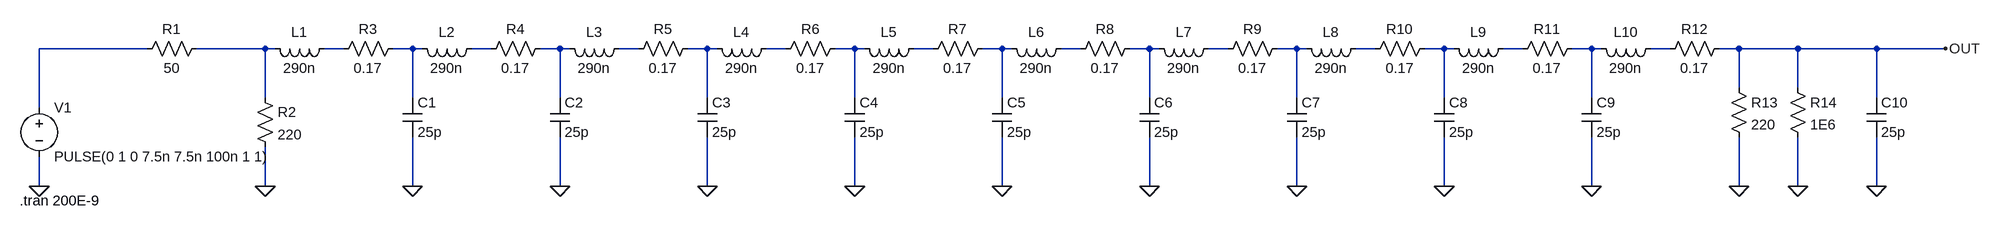
[diagram p0: schematic 10 cell_C.asc]
10 cell_C.asc, the LTspice schematic file:
Version 4
SHEET 1 1348 680
WIRE -1648 16 -1824 16
WIRE -1456 16 -1568 16
WIRE -1440 16 -1456 16
WIRE -1328 16 -1360 16
WIRE -1216 16 -1248 16
WIRE -1200 16 -1216 16
WIRE -1088 16 -1120 16
WIRE -976 16 -1008 16
WIRE -960 16 -976 16
WIRE -848 16 -880 16
WIRE -736 16 -768 16
WIRE -720 16 -736 16
WIRE -608 16 -640 16
WIRE -496 16 -528 16
WIRE -480 16 -496 16
WIRE -368 16 -400 16
WIRE -256 16 -288 16
WIRE -240 16 -256 16
WIRE -128 16 -160 16
WIRE -16 16 -48 16
WIRE 0 16 -16 16
WIRE 112 16 80 16
WIRE 224 16 192 16
WIRE 240 16 224 16
WIRE 352 16 320 16
WIRE 464 16 432 16
WIRE 480 16 464 16
WIRE 592 16 560 16
WIRE 704 16 672 16
WIRE 720 16 704 16
WIRE 832 16 800 16
WIRE 944 16 912 16
WIRE 1040 16 944 16
WIRE 1168 16 1040 16
WIRE 1280 16 1168 16
WIRE 944 80 944 16
WIRE 1040 80 1040 16
WIRE -1456 96 -1456 16
WIRE -1216 96 -1216 16
WIRE -976 96 -976 16
WIRE -736 96 -736 16
WIRE -496 96 -496 16
WIRE -256 96 -256 16
WIRE -16 96 -16 16
WIRE 224 96 224 16
WIRE 464 96 464 16
WIRE 704 96 704 16
WIRE 1168 96 1168 16
WIRE -1824 112 -1824 16
WIRE -1824 240 -1824 192
WIRE -1456 240 -1456 176
WIRE -1216 240 -1216 160
WIRE -976 240 -976 160
WIRE -736 240 -736 160
WIRE -496 240 -496 160
WIRE -256 240 -256 160
WIRE -16 240 -16 160
WIRE 224 240 224 160
WIRE 464 240 464 160
WIRE 704 240 704 160
WIRE 944 240 944 160
WIRE 1040 240 1040 160
WIRE 1168 240 1168 160
FLAG -1824 240 0
FLAG -1456 240 0
FLAG -1216 240 0
FLAG -976 240 0
FLAG -736 240 0
FLAG -496 240 0
FLAG -256 240 0
FLAG -16 240 0
FLAG 224 240 0
FLAG 464 240 0
FLAG 704 240 0
FLAG 944 240 0
FLAG 1040 240 0
FLAG 1168 240 0
FLAG 1280 16 OUT
SYMBOL voltage -1824 96 R0
WINDOW 123 0 0 Left 0
WINDOW 39 0 0 Left 0
SYMATTR InstName V1
SYMATTR Value PULSE(0 1 0 7.5n 7.5n 100n 1 1)
SYMBOL res -1552 0 R90
WINDOW 0 0 56 VBottom 2
WINDOW 3 32 56 VTop 2
SYMATTR InstName R1
SYMATTR Value 50
SYMBOL res -1472 80 R0
SYMATTR InstName R2
SYMATTR Value 220
SYMBOL ind -1344 0 R90
WINDOW 0 5 56 VBottom 2
WINDOW 3 32 56 VTop 2
SYMATTR InstName L1
SYMATTR Value 290n
SYMBOL res -1232 0 R90
WINDOW 0 0 56 VBottom 2
WINDOW 3 32 56 VTop 2
SYMATTR InstName R3
SYMATTR Value 0.17
SYMBOL cap -1232 96 R0
SYMATTR InstName C1
SYMATTR Value 25p
SYMBOL ind -1104 0 R90
WINDOW 0 5 56 VBottom 2
WINDOW 3 32 56 VTop 2
SYMATTR InstName L2
SYMATTR Value 290n
SYMBOL res -992 0 R90
WINDOW 0 0 56 VBottom 2
WINDOW 3 32 56 VTop 2
SYMATTR InstName R4
SYMATTR Value 0.17
SYMBOL cap -992 96 R0
SYMATTR InstName C2
SYMATTR Value 25p
SYMBOL ind -864 0 R90
WINDOW 0 5 56 VBottom 2
WINDOW 3 32 56 VTop 2
SYMATTR InstName L3
SYMATTR Value 290n
SYMBOL res -752 0 R90
WINDOW 0 0 56 VBottom 2
WINDOW 3 32 56 VTop 2
SYMATTR InstName R5
SYMATTR Value 0.17
SYMBOL cap -752 96 R0
SYMATTR InstName C3
SYMATTR Value 25p
SYMBOL ind -624 0 R90
WINDOW 0 5 56 VBottom 2
WINDOW 3 32 56 VTop 2
SYMATTR InstName L4
SYMATTR Value 290n
SYMBOL res -512 0 R90
WINDOW 0 0 56 VBottom 2
WINDOW 3 32 56 VTop 2
SYMATTR InstName R6
SYMATTR Value 0.17
SYMBOL cap -512 96 R0
SYMATTR InstName C4
SYMATTR Value 25p
SYMBOL ind -384 0 R90
WINDOW 0 5 56 VBottom 2
WINDOW 3 32 56 VTop 2
SYMATTR InstName L5
SYMATTR Value 290n
SYMBOL res -272 0 R90
WINDOW 0 0 56 VBottom 2
WINDOW 3 32 56 VTop 2
SYMATTR InstName R7
SYMATTR Value 0.17
SYMBOL cap -272 96 R0
SYMATTR InstName C5
SYMATTR Value 25p
SYMBOL ind -144 0 R90
WINDOW 0 5 56 VBottom 2
WINDOW 3 32 56 VTop 2
SYMATTR InstName L6
SYMATTR Value 290n
SYMBOL res -32 0 R90
WINDOW 0 0 56 VBottom 2
WINDOW 3 32 56 VTop 2
SYMATTR InstName R8
SYMATTR Value 0.17
SYMBOL cap -32 96 R0
SYMATTR InstName C6
SYMATTR Value 25p
SYMBOL ind 96 0 R90
WINDOW 0 5 56 VBottom 2
WINDOW 3 32 56 VTop 2
SYMATTR InstName L7
SYMATTR Value 290n
SYMBOL res 208 0 R90
WINDOW 0 0 56 VBottom 2
WINDOW 3 32 56 VTop 2
SYMATTR InstName R9
SYMATTR Value 0.17
SYMBOL cap 208 96 R0
SYMATTR InstName C7
SYMATTR Value 25p
SYMBOL ind 336 0 R90
WINDOW 0 5 56 VBottom 2
WINDOW 3 32 56 VTop 2
SYMATTR InstName L8
SYMATTR Value 290n
SYMBOL res 448 0 R90
WINDOW 0 0 56 VBottom 2
WINDOW 3 32 56 VTop 2
SYMATTR InstName R10
SYMATTR Value 0.17
SYMBOL cap 448 96 R0
SYMATTR InstName C8
SYMATTR Value 25p
SYMBOL ind 576 0 R90
WINDOW 0 5 56 VBottom 2
WINDOW 3 32 56 VTop 2
SYMATTR InstName L9
SYMATTR Value 290n
SYMBOL res 688 0 R90
WINDOW 0 0 56 VBottom 2
WINDOW 3 32 56 VTop 2
SYMATTR InstName R11
SYMATTR Value 0.17
SYMBOL cap 688 96 R0
SYMATTR InstName C9
SYMATTR Value 25p
SYMBOL ind 816 0 R90
WINDOW 0 5 56 VBottom 2
WINDOW 3 32 56 VTop 2
SYMATTR InstName L10
SYMATTR Value 290n
SYMBOL res 928 0 R90
WINDOW 0 0 56 VBottom 2
WINDOW 3 32 56 VTop 2
SYMATTR InstName R12
SYMATTR Value 0.17
SYMBOL res 928 64 R0
SYMATTR InstName R13
SYMATTR Value 220
SYMBOL res 1024 64 R0
SYMATTR InstName R14
SYMATTR Value 1E6
SYMBOL cap 1152 96 R0
SYMATTR InstName C10
SYMATTR Value 25p
TEXT -1856 264 Left 2 !.tran 200E-9

The netlist it stands for:
* 10 cell_C.asc
V1 N001 0 PULSE(0 1 0 7.5n 7.5n 100n 1 1)
R1 N002 N001 50
R2 N002 0 220
L1 N003 N002 290n
R3 N004 N003 0.17
C1 N004 0 25p
L2 N005 N004 290n
R4 N006 N005 0.17
C2 N006 0 25p
L3 N007 N006 290n
R5 N008 N007 0.17
C3 N008 0 25p
L4 N009 N008 290n
R6 N010 N009 0.17
C4 N010 0 25p
L5 N011 N010 290n
R7 N012 N011 0.17
C5 N012 0 25p
L6 N013 N012 290n
R8 N014 N013 0.17
C6 N014 0 25p
L7 N015 N014 290n
R9 N016 N015 0.17
C7 N016 0 25p
L8 N017 N016 290n
R10 N018 N017 0.17
C8 N018 0 25p
L9 N019 N018 290n
R11 N020 N019 0.17
C9 N020 0 25p
L10 N021 N020 290n
R12 OUT N021 0.17
R13 OUT 0 220
R14 OUT 0 1E6
C10 OUT 0 25p
.tran 200E-9
.backanno
.end